# Altium schematic sheet voltage_converter.SchDoc
size 381 x 241 mm; SheetNumber: 1; SheetTotal: 3
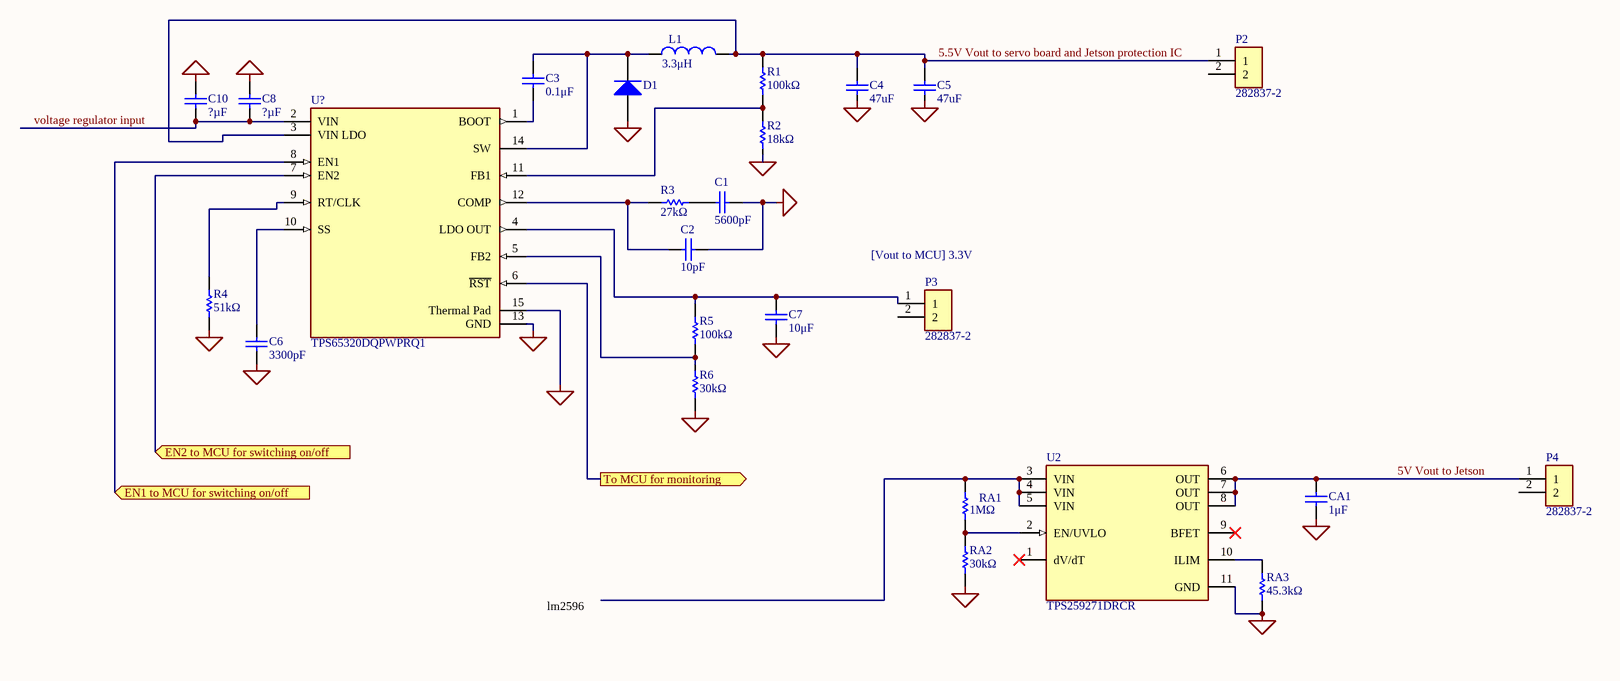
[diagram p0: voltage_converter.SchDoc]

## Parts
C1  value 5600pF  (hidden comment: Capacitor)
C2  value 10pF  (hidden comment: Capacitor)
C3  value 0.1μF  (hidden comment: Capacitor)
C4  value 47uF  (hidden comment: Capacitor)
C5  value 47uF  (hidden comment: Capacitor)
C6  value 3300pF  (hidden comment: Capacitor)
C7  value 10μF  (hidden comment: Capacitor)
C8  value ?µF  (hidden comment: Capacitor)
C10  value ?µF  (hidden comment: Capacitor)
CA1  value 1μF  (hidden comment: Capacitor)
D1  MBRA340T3G  [ONSC-SMA-2-403D-02_F_V]  (value not drawn)
L1  value 3.3μH  (hidden comment: Inductor)
P2  282837-2  [TE_282837-2]
P3  282837-2  [TE_282837-2]
P4  282837-2  [TE_282837-2]
R1  value 100kΩ  (hidden comment: Resistor)
R2  value 18kΩ  (hidden comment: Resistor)
R3  value 27kΩ  (hidden comment: Resistor)
R4  value 51kΩ  (hidden comment: Resistor)
R5  value 100kΩ  (hidden comment: Resistor)
R6  value 30kΩ  (hidden comment: Resistor)
RA1  value 1MΩ  (hidden comment: Resistor)
RA2  value 30kΩ  (hidden comment: Resistor)
RA3  value 45.3kΩ  (hidden comment: Resistor)
U2  TPS259271DRCR  [FP-DRC0010J-IPC_A]
U?  TPS65320DQPWPRQ1  [FP-PWP0014G-MFG]

## Ports
EN1 to MCU for switching on/off (in), EN2 to MCU for switching on/off (in), To MCU for monitoring (out)

## Nets
GND: C1.1 C2.1 C6.1 C7.1 C8.2 C10.2 CA1.1 D1.2(A) R2.1 R4.1 R6.1 RA2.1 RA3.1 U2.11(GND) U?.13(GND) U?.15(Thermal_Pad)
5.5V Vout to servo board and Jetson protection IC: C4.1 C5.1 L1.2 P2.1 R1.2 U?.3(VIN_LDO)
5V Vout to Jetson: CA1.2 P4.1 U2.6(OUT) U2.7(OUT) U2.8(OUT)
EN1 to MCU for switching on/off: U?.8(EN1) ; port EN1 to MCU for switching on/off
EN2 to MCU for switching on/off: U?.7(EN2) ; port EN2 to MCU for switching on/off
To MCU for monitoring: U?.6(~{RST}) ; port To MCU for monitoring
voltage regulator input: C8.1 C10.1 U?.2(VIN)
NetC1_2: C1.2 R3.1
NetC2_2: C2.2 R3.2 U?.12(COMP)
NetC3_1: C3.1 D1.1(K) L1.1 U?.14(SW)
NetC3_2: C3.2 U?.1(BOOT)
NetC6_2: C6.2 U?.10(SS)
NetC7_2: C7.2 P3.1 R5.2 U?.4(LDO_OUT)
NetR1_1: R1.1 R2.2 U?.11(FB1)
NetR4_2: R4.2 U?.9(RT/CLK)
NetR5_1: R5.1 R6.2 U?.5(FB2)
NetRA1_1: RA1.1 RA2.2 U2.2(EN/UVLO)
NetRA1_2: RA1.2 U2.3(VIN) U2.4(VIN) U2.5(VIN)
NetRA3_2: RA3.2 U2.10(ILIM)

Not connected (* = marked no-connect by the designer): C4 2; C5 2; P2 2; P3 2; P4 2; U2 1(dV/dT)* 9(BFET)*

## Notes on the sheet
- (near P3) [Vout to MCU] 3.3V
- lm2596
- Labels drawn without touching a wire or pin: GND

## Library data of the parts
C1-C8 C10 CA1 = Capacitor: SimulationGenericComponent: True
D1 = CMP-1055-00306-1: Schottky Power Rectifier, 2-Pin SMA, Pb-Free, Tape and Reel; Manufacturer: On Semiconductor; IFSM Max (A): 100; Configuration: Single; PackageVersion: Rev. F, 11/2008; ComponentLink1URL: http://www.onsemi.com/; Packing: Tape and Reel; PackageReference: SMA-2-403D-02_F; DatasheetVersion: Rev. 6; ComponentLink3URL: http://www.onsemi.com/pub_link/Collateral/1SMA5913BT3-D.PDF; ComponentLink2Description: Datasheet; PackageDescription: 2-Pin Small Molded Package, J-Bend Lead, Body 2.605 x 4.315 mm; ComponentLink3Description: Package Specification; PartNumber: MBRA340T3G; RoHS: TRUE; ComponentLink1Description: Manufacturer URL; ComponentLink2URL: http://www.onsemi.cn/pub_link/Collateral/MBRA340T3-D.PDF; Mounting Technology: Surface Mount
L1 = Inductor: SimulationGenericComponent: True
P2-P4 = 282837-2: Ð Ð°Ð·ÑŠÐµÐ¼Ð½Ñ‹Ðµ ÐºÐ»ÐµÐ¼Ð¼Ð½Ñ‹Ðµ ÐºÐ¾Ð»Ð¾Ð´ÐºÐ¸ Ð Ð¾Ð·ÐµÑ‚ÐºÐ° 2 Ð¿Ð¾Ð»Ð¾Ð¶ÐµÐ½Ð¸Ñ 5,08 Ð¼Ð¼ ÐŸÑ€Ð¸Ð¿Ð¾Ð¹ Ð¿Ñ€ÑÐ¼Ð¾Ð¹ Ñ‡ÐµÑ€ÐµÐ· Ð¾Ñ‚Ð²ÐµÑ€ÑÑ‚Ð¸Ðµ 13,5 Ð / ÐºÐ¾Ð½Ñ‚Ð°ÐºÑ‚; MF: TE Connectivity; SnapEDA_Link: https://www.snapeda.com/parts/282837-2/TE+Connectivity+AMP+Connectors/view-part/?ref=snap; Price: None; Check_prices: https://www.snapeda.com/parts/282837-2/TE+Connectivity+AMP+Connectors/view-part/?ref=eda; Purchase-URL: https://pricing.snapeda.com/search/part/282837-2/?ref=eda; MP: 282837-2; Value: *; Availability: In Stock; Package: None
R1-R6 RA1-RA3 = Resistor: TC1: 0; SimulationGenericComponent: True; TC2: 0
U2 = CMP-04910-000037-1: IC EFUSE 18V BFET DVR 5A 10VSON; Operating Supply Voltage: 12V; Min Supply Voltage: 4.5V; Max Supply Current: 550uA; Number of Channels: 1; Operating Supply Current: 420uA; Lead Free: Lead Free; Max Supply Voltage: 18V; Mount: Surface Mount; RoHS Compliant: Yes; Min Operating Temperature: -40°C; Max Output Current: 5A; Features: Auto Retry; Packaging: Tape and Reel; Max Operating Temperature: 85°C; Contact Plating: Gold; Number of Pins: 10
U? = CMP-04910-000143-1: IC REG DL BUCK/LINEAR 14HTSSOP; RoHS Compliant: Yes; Min Operating Temperature: -40°C; Features: UVLO; Max Operating Temperature: 125°C